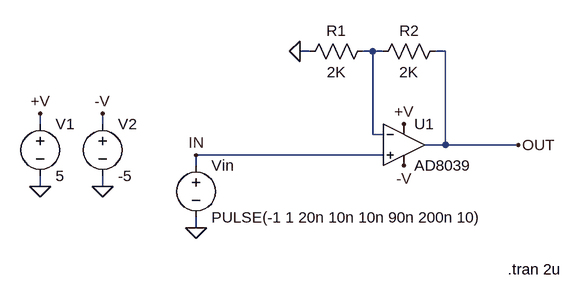
[diagram p0: schematic AD8039.asc]
AD8039.asc, the LTspice schematic file:
Version 4
SHEET 1 1240 700
WIRE 352 -1184 336 -1184
WIRE 448 -1184 432 -1184
WIRE 464 -1184 448 -1184
WIRE 560 -1184 544 -1184
WIRE -64 -1072 -64 -1088
WIRE 32 -1072 32 -1088
WIRE 448 -1056 448 -1184
WIRE 464 -1056 448 -1056
WIRE 560 -1040 560 -1184
WIRE 560 -1040 528 -1040
WIRE 672 -1040 560 -1040
WIRE 464 -1024 176 -1024
WIRE 176 -1008 176 -1024
WIRE -64 -976 -64 -992
WIRE 32 -976 32 -992
WIRE 176 -912 176 -928
FLAG 176 -912 0
FLAG 672 -1040 OUT
FLAG 176 -1024 IN
FLAG 496 -1072 +V
FLAG 496 -1008 -V
FLAG 336 -1184 0
FLAG -64 -1088 +V
FLAG -64 -976 0
FLAG 32 -1088 -V
FLAG 32 -976 0
SYMBOL res 448 -1200 R90
WINDOW 0 0 56 VBottom 2
WINDOW 3 32 56 VTop 2
SYMATTR InstName R1
SYMATTR Value 2K
SYMBOL res 560 -1200 R90
WINDOW 0 0 56 VBottom 2
WINDOW 3 32 56 VTop 2
SYMATTR InstName R2
SYMATTR Value 2K
SYMBOL Opamps\\AD8039 496 -1104 R0
SYMATTR InstName U1
SYMBOL voltage 176 -1024 R0
WINDOW 123 24 146 Left 2
WINDOW 39 24 125 Left 2
SYMATTR InstName Vin
SYMATTR Value PULSE(-1 1 20n 10n 10n 90n 200n 10)
SYMBOL voltage -64 -1088 R0
WINDOW 123 0 0 Left 2
WINDOW 39 0 0 Left 2
SYMATTR InstName V1
SYMATTR Value 5
SYMBOL voltage 32 -1088 R0
WINDOW 123 24 146 Left 2
WINDOW 39 24 125 Left 2
SYMATTR InstName V2
SYMATTR Value -5
TEXT 656 -848 Left 2 !.tran 2u

The netlist it stands for:
* AD8039.asc
R1 N001 0 2K
R2 OUT N001 2K
XU1 IN N001 +V -V OUT AD8039  ; pins In+ In- V+ V- OUT
Vin IN 0 PULSE(-1 1 20n 10n 10n 90n 200n 10)
V1 +V 0 5
V2 -V 0 -5
.tran 2u
.backanno
.end